# EAGLE schematic AcceleratedLED (EAGLE 9.2.2)
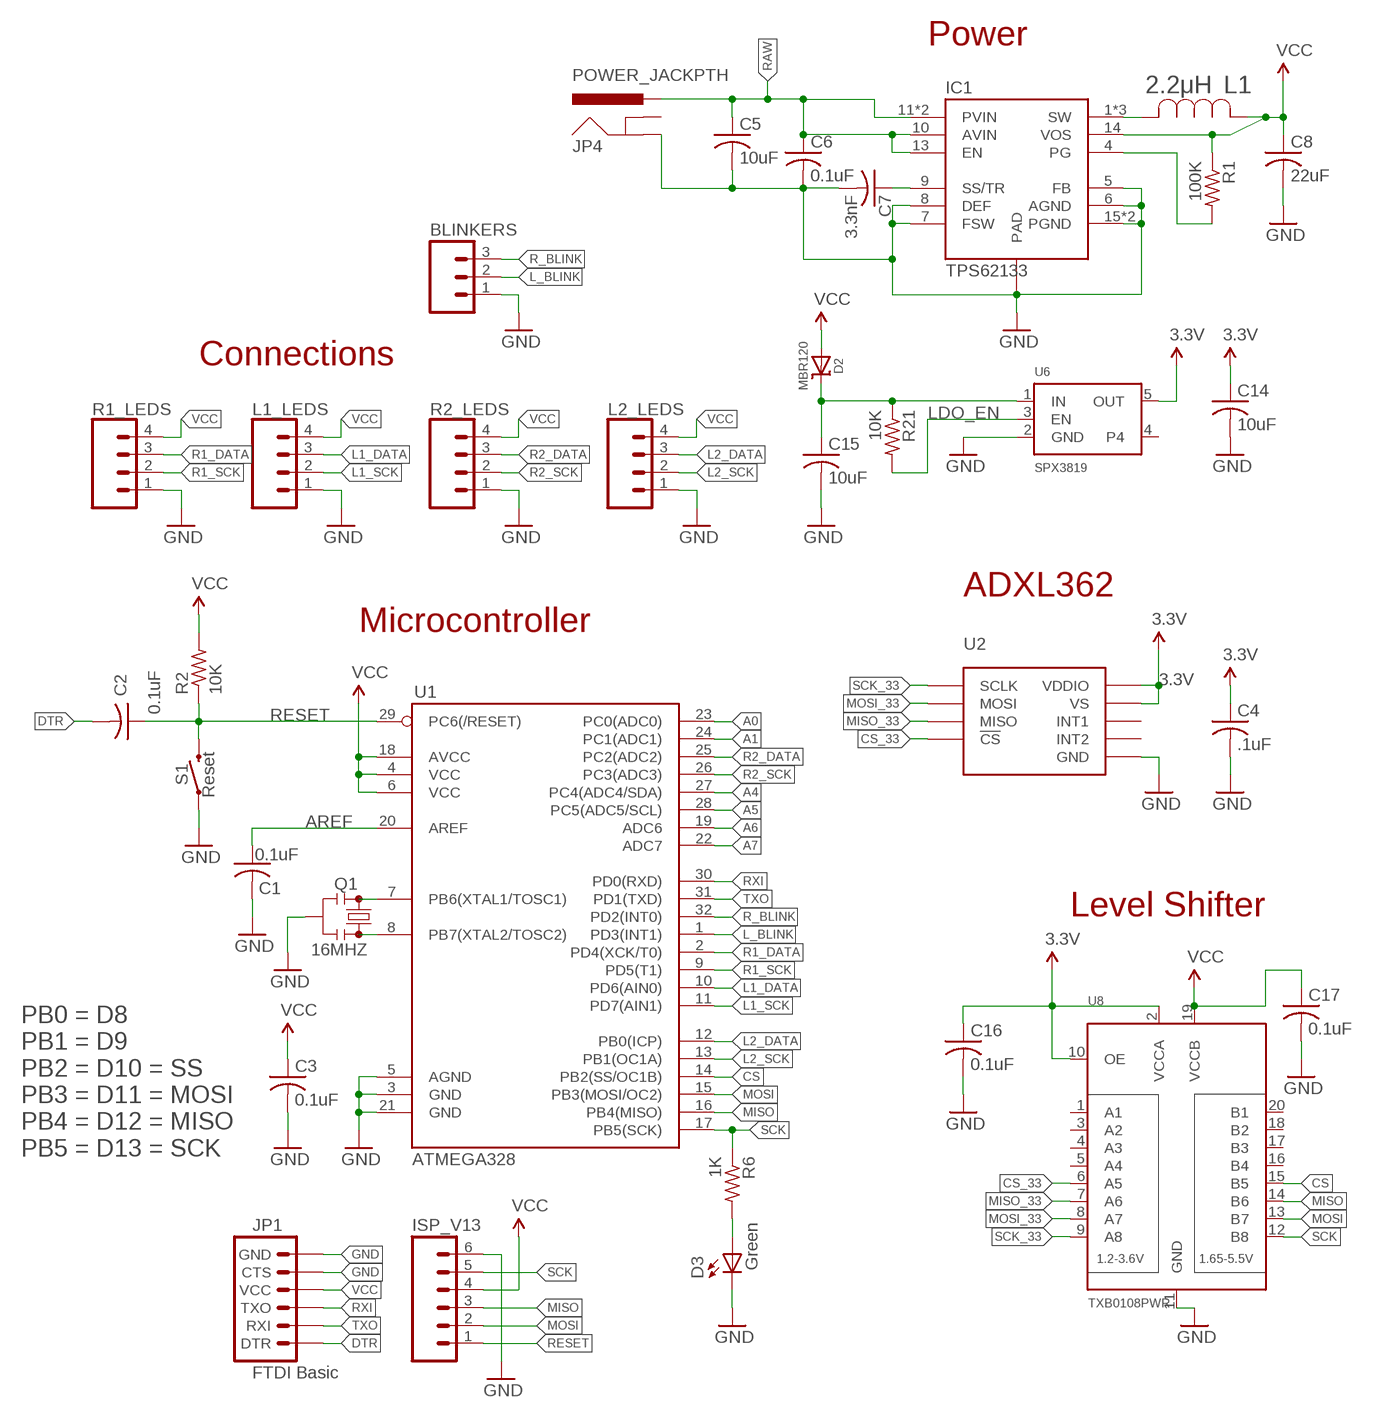
[diagram p0: schematic, sheet 1]

## Parts
BLINKERS  M03JST-PTH  [JST-3-PTH]
C1  0.1uF  C-USC0805  [C0805]
C2  0.1uF  C-USC0805  [C0805]
C3  0.1uF  C-USC0805  [C0805]
C4  .1uF  C-USC0805  [C0805]
C5  10uF  C-USC0805  [C0805]
C6  0.1uF  C-USC0805  [C0805]
C7  3.3nF  C-USC0805  [C0805]
C8  22uF  C-USC0805  [C0805]
C14  10uF  C-USC0805  [C0805]
C15  10uF  C-USC0805  [C0805]
C16  0.1uF  C-USC0805  [C0805]
C17  0.1uF  C-USC0805  [C0805]
D2  MBR120  DIODE-SCHOTTKYSOD-123  [SOD-123]
D3  Green  LEDCHIPLED_0805  [CHIPLED_0805]
IC1  TPS62133  [QFN16]
ISP_V13  M06SIP  [1X06]
JP1  FTDI Basic  ARDUINO_SERIAL_PROGRAMPTH  [1X06]
JP4  POWER_JACKPTH  [POWER_JACK_PTH]
L1  2.2μH  IHLP1212BZER2R2M11IND_IHLP-1212BZ-L  [IND_IHLP-1212BZ-L]
L1_LEDS  CONN_04JST-PTH  [JST-4-PTH]
L2_LEDS  CONN_04JST-PTH  [JST-4-PTH]
Q1  16MHZ  RESONATOR16MHZ  [RESONATOR-SMD]
R1  100K  R-US_M0805  [M0805]
R1_LEDS  CONN_04JST-PTH  [JST-4-PTH]
R2  10K  R-US_M0805  [M0805]
R2_LEDS  CONN_04JST-PTH  [JST-4-PTH]
R6  1K  R-US_M0805  [M0805]
R21  10K  R-US_M0805  [M0805]
S1  Reset  MOMENTARY-SWITCH-SPST-SMD-5.2-REDUNDANT  [TACTILE_SWITCH_SMD_5.2MM]
U1  ATMEGA328  ATMEGA168  [TQFP32-08]
U2  ADXL362ADXL362-1:1  [ADXL362-1:1]
U6  SPX3819  VREG_SOT23-5  [SOT23-5]
U8  TXB0108PWR  [TSSOP20]

## Nets
3.3V: C4.1 C14.1 C16.1 U2.P$1(VDDIO) U2.P$14(VS) U6.5(OUT) U8.2(VCCA) U8.10(OE)
A0: U1.23(PC0(ADC0))
A1: U1.24(PC1(ADC1))
A4: U1.27(PC4(ADC4/SDA))
A5: U1.28(PC5(ADC5/SCL))
A6: U1.19(ADC6)
A7: U1.22(ADC7)
AREF: C1.1 U1.20(AREF)
CS: U1.14(PB2(SS/OC1B)) U8.15(B5)
CS_33: U2.P$8(!CS) U8.6(A5)
DTR: C2.2 JP1.1(DTR)
GND [vcc]: BLINKERS.1 C1.2 C3.2 C4.2 C5.2 C6.2 C7.2 C8.2 C14.2 C15.2 C16.2 C17.2 D3.C IC1.5(FB) IC1.6(AGND) IC1.7(FSW) IC1.8(DEF) IC1.15(PGND) IC1.16(PGND) IC1.PAD ISP_V13.6 JP1.5(CTS) JP1.6(GND) JP4.GND L1_LEDS.1 L2_LEDS.1 Q1.2 R1_LEDS.1 R2_LEDS.1 S1.1 S1.2 U1.3(GND) U1.5(AGND) U1.21(GND) U2.P$12(GND) U2.P$13(GND) U2.P$16(GND) U6.2(GND) U8.11(GND)
L1_DATA: L1_LEDS.3 U1.10(PD6(AIN0))
L1_SCK: L1_LEDS.2 U1.11(PD7(AIN1))
L2_DATA: L2_LEDS.3 U1.12(PB0(ICP))
L2_SCK: L2_LEDS.2 U1.13(PB1(OC1A))
L_BLINK: BLINKERS.2 U1.1(PD3(INT1))
LDO_EN: R21.2 U6.3(EN)
MISO: ISP_V13.3 U1.16(PB4(MISO)) U8.14(B6)
MISO_33: U2.P$7(MISO) U8.7(A6)
MOSI: ISP_V13.2 U1.15(PB3(MOSI/OC2)) U8.13(B7)
MOSI_33: U2.P$6(MOSI) U8.8(A7)
N$1: Q1.3 U1.8(PB7(XTAL2/TOSC2))
N$2: Q1.1 U1.7(PB6(XTAL1/TOSC1))
N$7: D3.A R6.2
N$23: C15.1 D2.C R21.1 U6.1(IN)
PG: IC1.4(PG) R1.2
R1_DATA: R1_LEDS.3 U1.2(PD4(XCK/T0))
R1_SCK: R1_LEDS.2 U1.9(PD5(T1))
R2_DATA: R2_LEDS.3 U1.25(PC2(ADC2))
R2_SCK: R2_LEDS.2 U1.26(PC3(ADC3))
R_BLINK: BLINKERS.3 U1.32(PD2(INT0))
RAW: C5.1 C6.1 IC1.10(AVIN) IC1.11(PVIN) IC1.12(PVIN) IC1.13(EN) JP4.PWR
RESET: C2.1 ISP_V13.1 R2.1 S1.3 S1.4 U1.29(PC6(/RESET))
RXI: JP1.3(TXO) U1.30(PD0(RXD))
SCK: ISP_V13.5 R6.1 U1.17(PB5(SCK)) U8.12(B8)
SCK_33: U2.P$4(SCLK) U8.9(A8)
SS/TR: C7.1 IC1.9(SS/TR)
SW: IC1.1(SW) IC1.2(SW) IC1.3(SW) L1.2
TXO: JP1.2(RXI) U1.31(PD1(TXD))
VCC [gnd]: C3.1 C8.1 C17.1 D2.A IC1.14(VOS) ISP_V13.4 JP1.4(VCC) L1.1 L1_LEDS.4 L2_LEDS.4 R1.1 R1_LEDS.4 R2.2 R2_LEDS.4 U1.4(VCC) U1.6(VCC) U1.18(AVCC) U8.19(VCCB)
Unconnected: JP4.GNDBREAK U2.P$9(INT2) U2.P$11(INT1) U6.4 U8.1(A1) U8.3(A2) U8.4(A3) U8.5(A4) U8.16(B4) U8.17(B3) U8.18(B2) U8.20(B1)

## Notes on the sheet
- Power
- Connections
- ADXL362
- Microcontroller
- Level Shifter
- PB0 = D8
  PB1 = D9
  PB2 = D10 = SS
  PB3 = D11 = MOSI
  PB4 = D12 = MISO
  PB5 = D13 = SCK

## Library data of the parts
BLINKERS = SparkFun-Connectors:M03: Header 3 Standard 3-pin 0.1" header. Use with straight break away headers (SKU : PRT-00116), right angle break away headers (PRT-00553), swiss pins (PRT-00743), machine pins (PRT-00117), and female headers (PRT-00115). Molex polarized connector foot print use with SKU : PRT-08232 with associated crimp pins and housings.; SKU: PRT-09915
C1-C3 C6 C7 C15 = MotionSign:C-US: CAPACITOR, American symbol
C4 C5 C8 C14 = RemoteMotion:C-US: CAPACITOR, American symbol; SPICEPREFIX: C
C16 C17 = rcl:C-US: CAPACITOR, American symbol; SPICEPREFIX: C
D2 = MotionSign:DIODE-SCHOTTKY
D3 = led:LED: LED OSRAM: - CHIPLED LG R971, LG N971, LY N971, LG Q971, LY Q971, LO R971, LY R971 LH N974, LH R974 LS Q976, LO Q976, LY Q976 LO Q996 - Hyper CHIPLED LW Q18S LB Q993, LB Q99A, LB R99A - SideLED LS A670, LO A670, LY A670, LG A670, LP A670 LB A673, LV A673, LT A673, LW A673 LH A674 LY A675 LS A676, LA A676, LO A676, LY A676, LW A676 LS A679, LY A679, LG A679 - Hyper Micro SIDELED® LS Y876, LA Y876, LO Y876, LY Y876 LT Y87S - SmartLED LW L88C, LW L88S LB L89C, LB L89S, LG L890 LS L89K, LO L89K, LY L89K LS L896, LA L896, LO L896, LY L896 - TOPLED LS T670, LO T670, LY T670, LG T670, LP T670 LSG T670, LSP T670, LSY T670, LOP T670, LYG T670 LG T671, LOG T671, LSG T671 LB T673, LV T673, LT T673, LW T673 LH T674 LS T676, LA T676, LO T676, LY T676, LB T676, LH T676, LSB T676, LW T676 LB T67C, LV T67C, LT T67C, LS T67K, LO T67K, LY T67K, LW E67C LS E67B, LA E67B, LO E67B, LY E67B, LB E67C, LV E67C, LT E67C LW T67C LS T679, LY T679, LG T679 LS T770, LO T770, LY T770, LG T770, LP T770 LB T773, LV T773, LT T773, LW T773 LH T774 LS E675, LA E675, LY E675, LS T675 LS T776, LA T776, LO T776, LY T776, LB T776 LHGB T686 LT T68C, LB T68C - Hyper Mini TOPLED® LB M676 - Mini TOPLED Santana® LG M470 LS M47K, LO M47K, LY M47K Source: http://www.osram.convergy.de LUXEON: - LUMILED® LXK2-PW12-R00, LXK2-PW12-S00, LXK2-PW14-U00, LXK2-PW14-V00 LXK2-PM12-R00, LXK2-PM12-S00, LXK2-PM14-U00 LXK2-PE12-Q00, LXK2-PE12-R00, LXK2-PE12-S00, LXK2-PE14-T00, LXK2-PE14-U00 LXK2-PB12-K00, LXK2-PB12-L00, LXK2-PB12-M00, LXK2-PB14-N00, LXK2-PB14-P00, LXK2-PB14-Q00 LXK2-PR12-L00, LXK2-PR12-M00, LXK2-PR14-Q00, LXK2-PR14-R00 LXK2-PD12-Q00, LXK2-PD12-R00, LXK2-PD12-S00 LXK2-PH12-R00, LXK2-PH12-S00 LXK2-PL12-P00, LXK2-PL12-Q00, LXK2-PL12-R00 Source: www.luxeon.com KINGBRIGHT: KA-3528ASYC Source: www.kingbright.com
IC1 = robopoly:TPS62133
ISP_V13 = MotionSign:M06: Header 6 Standard 6-pin 0.1" header. Use with straight break away headers (SKU : PRT-00116), right angle break away headers (PRT-00553), swiss pins (PRT-00743), machine pins (PRT-00117), and female headers (PRT-00115). Molex polarized connector foot print use with SKU : PRT-08094 with associated crimp pins and housings. NOTES ON THE VARIANTS LOCK and LOCK_LONGPADS... This footprint was designed to help hold the alignment of a through-hole component (i.e. 6-pin header) while soldering it into place. You may notice that each hole has been shifted either up or down by 0.005 of an inch from it's more standard position (which is a perfectly straight line). This slight alteration caused the pins (the squares in the middle) to touch the edges of the holes. Because they are alternating, it causes a "brace" to hold the component in place. 0.005 has proven to be the perfect amount of "off-center" position when using our standard breakaway headers. Although looks a little odd when you look at the bare footprint, once you have a header in there, the alteration is very hard to notice. Also, if you push a header all the way into place, it is covered up entirely on the bottom side. This idea of altering the position of holes to aid alignment will be further integrated into the Sparkfun Library for other footprints. It can help hold any component with 3 or more connection pins.
JP1 = MotionSign:ARDUINO_SERIAL_PROGRAM
JP4 = MotionSign:POWER_JACK: Power Jack This is the standard 5.5mm barrel jack for power. The PTH is the most common, proven, reliable, footprint. The Slot footprint only works if the mill layer is transmitted to the PCB fab house so be warned. Mating wall wart : TOL-00298 (and others); PROD_ID: CONN-08197
L1 = bg_eagle_lib:IHLP1212BZER2R2M11; MANUFACTURER_PART_NUMBER: IHLP1212BZER2R2M11; VENDOR: VISHAY
L1_LEDS L2_LEDS R1_LEDS R2_LEDS = MotionSign:CONN_04: Multi connection point. Often used as Generic Header-pin footprint for 0.1 inch spaced/style header connections On any of the 0.1 inch spaced packages, you can populate with these: Break Away Headers - Straight <https://www.sparkfun.com/products/116> (PRT-00116) Break Away Male Headers - Right Angle <https://www.sparkfun.com/products/553> (PRT-00553) Female Headers <https://www.sparkfun.com/products/115> (PRT-00115) Break Away Headers - Machine Pin <https://www.sparkfun.com/products/117> (PRT-00117) Break Away Female Headers - Swiss Machine Pin <https://www.sparkfun.com/products/743> (PRT-00743) For SCREWTERMINALS and SPRING TERMINALS visit here: Screw Terimnals on SparkFun.com <https://www.sparkfun.com/search/results?term=Screw+Terminals> (5mm/3.5mm/2.54mm spacing) This device is also useful as a general connection point to wire up your design to another part of your project. Our various solder wires solder well into these plated through hole pads. Hook-Up Wire - Assortment (Stranded, 22 AWG) <https://www.sparkfun.com/products/11375> (PRT-11375) Hook-Up Wire - Assortment (Solid Core, 22 AWG) <https://www.sparkfun.com/products/11367> (PRT-11367) View the entire wire category on our website here <https://www.sparkfun.com/categories/141> Special notes: Molex polarized connector foot print use with SKU : PRT-08231 with associated crimp pins and housings. 1MM SMD Version SKU: PRT-10208; PROD_ID: WIRE-13531; SF_ID: PRT-09916
Q1 = MotionSign:RESONATOR: Resonator Small SMD resonator. Used, eg, on the Arduino Pro/ Pro Mini boards. 8MHz- XTAL-08895 16MHz- XTAL-08900; PROD_ID: XTAL-08900
R1 R2 R6 R21 = MotionSign:R-US_: RESISTOR, American symbol
S1 = MotionSign:MOMENTARY-SWITCH-SPST: Momentary Switch (Pushbutton) - SPST Normally-open (NO) SPST momentary switches (buttons, pushbuttons). Variants PTH-12MM - 12mm square, through-hole Momentary Pushbutton Switch - 12mm Square <https://www.sparkfun.com/products/9190> (COM-09190) PTH-6.0MM, PTH-6.0MM-KIT - 6.0mm square, through-hole Mini Pushbutton Switch <https://www.sparkfun.com/products/97> (COM-00097) KIT package intended for soldering kit's - only one side of pads' copper is exposed. PTH-RIGHT-ANGLE-KIT - Right-angle, through-hole Right Angle Tactile Button <https://www.sparkfun.com/products/10791> - Used on SparkFun BigTime Watch Kit <https://www.sparkfun.com/products/11734> SMD-12MM - 12mm square, surface-mount Tactile Button - SMD (12mm) <https://www.sparkfun.com/products/12993> (COM-12993) Used on SparkFun PicoBoard <https://www.sparkfun.com/products/11888> SMD-4.5MM - 4.5mm Square Trackball Switch Used on SparkFun Blackberry Trackballer Breakout <https://www.sparkfun.com/products/13169> SMD-4.6MMX2.8MM - 4.60mm x 2.80mm, surface mount Used on SparkFun SAMD21 Mini Breakout <https://www.sparkfun.com/products/13664> SMD-5.2MM, SMD-5.2-REDUNDANT - 5.2mm square, surface-mount Mini Pushbutton Switch - SMD <https://www.sparkfun.com/products/8720> (COM-08720) Used on Arduino Pro Mini <https://www.sparkfun.com/products/11114> REDUNDANT package connects both switch circuits together SMD-6.0X3.5MM - 6.0 x 3.5mm, surface mount Momentary Reset Switch SMD <https://www.sparkfun.com/products/8229> (COM-08229) SMD-6.2MM-TALL - 6.2mm square, surface mount Tactile Button - SMD (6mm) <https://www.sparkfun.com/products/12992> Used on SparkFun Digital Sandbox <https://www.sparkfun.com/products/12651> SMD-RIGHT-ANGLE - Right-angle, surface mount Used on SparkFun Block for Intel® Edison - Arduino <https://www.sparkfun.com/products/13036>; PROD_ID: SWCH-08247; SF_SKU: COM-08720
U1 = MotionSign:ATMEGA168
U2 = SparkFun-Sensors:ADXL362: Micropower 3-axis accelerometer 2/4/8g digital output (SPI) IC-11297
U6 = MotionSign:VREG_SOT23-5: SOT23-5 Fixed Voltage Regulators Part Current Out V Out V In V Dropout θJA (°C/W) TJ (°C) Digikey Part No. ADP121 150mA 3.3V 3.4-5.5V 0.09V @ 150mA -- -- ADP121-AUJZ33R7CT-ND ADP121 150mA 3.0V 3.1-5.5V 0.09V @ 150mA -- -- ADP121-AUJZ30R7CT-ND ADP122 300mA 3.3V 3.4-5.5V 0.085V @ 300mA -- -- ADP122AUJZ-3.3-R7CT-ND ADP1712 300mA 3.3V 3.5-5.5V 0.17V @ 300mA -- -- ADP1712AUJZ-3.3-R7TR-ND AP7311 (Low Cost) 150mA 3.3V 3.5-6V 0.15V @ 150mA -- -- AP7311-33WG-7DICT-ND LD39015M18R 150mA 1.8V 1.9V-5.5V 0.08V @ 100mA -- -- 497-6977-1-ND LP2985A-33DBVR 150mA 3.3V 3.3-16V 0.28V @ 150mA 206 150 296-18479-1-ND MCP1824T-3302E/OT 300mA 3.3V 3.5V-6V 0.2V @ 300mA -- -- MCP1824T-3302E/OTCT-ND MIC5205-2.5YM5 TR 150mA 2.5V 2.7-16V 0.165V @ 150mA -- -- 576-1257-2-ND MIC5205-3.0YM5 TR 150mA 3.0V 3.2V-16V 0.165V @ 150mA -- -- 576-1258-2-ND MIC5205-3.3YM5 TR 150mA 3.3V 3.5V-16V 0.165V @ 150mA -- -- 576-1259-2-ND TPS780330220 150mA 3.3V+2.2V 3.6-5.5V 250mV Max -- -- 296-23332-1-ND TDA3663/N1,135 100mA 3.3V 3.5-45V 0.18V @ 50mA -- -- 568-5343-1-ND Max operating temp can be calculated using θJA, TJ (max junction temperature), and power in watts. Set the "Maximum Ambient Temperature" until it reaches TJ ("Max Junction Temperature"), which is the absolute limit for safe use of the regulator: Heat Sink Temperature Calculator <http://www.daycounter.com/Calculators/Heat-Sink-Temperature-Calculator.phtml> For example, With 12V source into a 3.3V LP2985 and a 30mA load, we are dissipating (12V-3.3V) * 0.03A = 0.261W. With a θJA of 206 °C/W, a TJ of 150°C, and 261mW we can safely use the chip without a heat sink up to 75°C (=147.1°C Junction Temperature).
U8 = MotionSign:TXB0108PWR: 8-Bit Bi-Directional Level Shifter 1.2V-3.6V (VCCA) to 1.65V-5.5V (VCCB) bi-directional level shifter with auto direction sensing. Max data rate - VCCA 1.8V: 20Mbps (50ns), VCCA 3.3V: 100Mbps (10ns) Digikey: 296-21527-1-ND

## Net classes
0 default: width 0.254 mm, drill 0.254 mm, clearance 0.254 mm
1 vcc: width 0.508 mm, drill 0.381 mm, clearance 0.254 mm
2 gnd: width 0.508 mm, drill 0.381 mm, clearance 0.254 mm